# EAGLE design lickometer_1_0 (EAGLE 6.6.0)
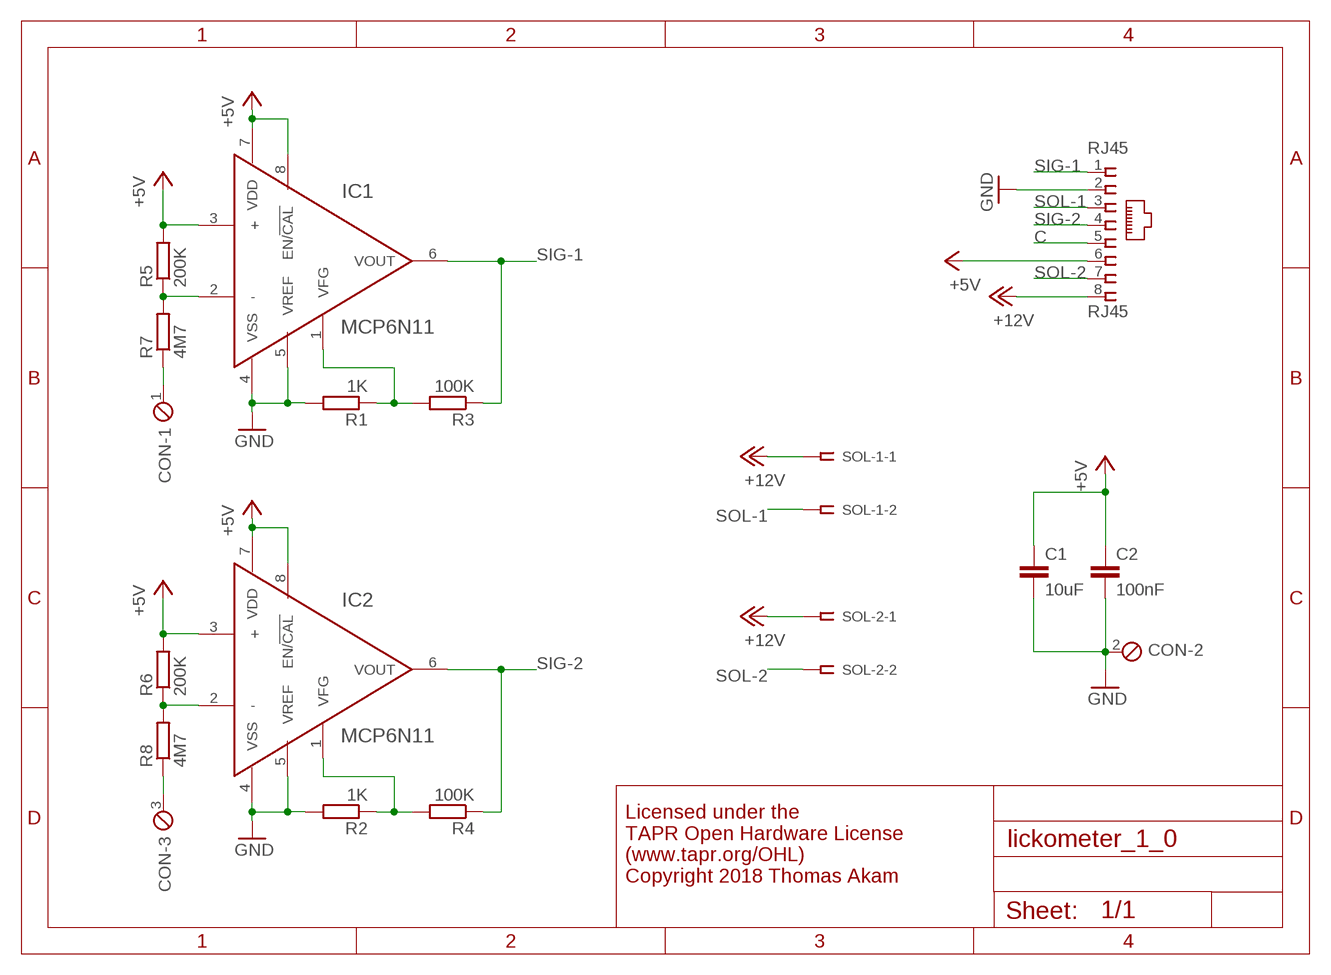
[diagram p0: schematic, sheet 1]

## Parts
C1  10uF  C-EUC1206  [C1206]
C2  100nF  C-EUC0805  [C0805]
CON  MPT3  [3POL254]
IC1  MCP6N11  [SOIC127P600X175-8N]
IC2  MCP6N11  [SOIC127P600X175-8N]
R1  1K  R-EU_R0805  [R0805]
R2  1K  R-EU_R0805  [R0805]
R3  100K  R-EU_R0805  [R0805]
R4  100K  R-EU_R0805  [R0805]
R5  200K  R-EU_R0805  [R0805]
R6  200K  R-EU_R0805  [R0805]
R7  4M7  R-EU_R0805  [R0805]
R8  4M7  R-EU_R0805  [R0805]
RJ45  RJ45  RJ45VERTICAL  [RJ45-NO-SHIELD-VERTICAL]
SOL-1  SSW-102-02-S-S-RA  [SSW-102-02-S-S-RA]
SOL-2  SSW-102-02-S-S-RA  [SSW-102-02-S-S-RA]

## Nets
+5V: C1.1 C2.1 IC1.3(+) IC1.7(VDD) IC1.8(EN/!CAL!) IC2.3(+) IC2.7(VDD) IC2.8(EN/!CAL!) R5.2 R6.2 RJ45.6
+12V: RJ45.8 SOL-1.1 SOL-2.1
C: RJ45.5
GND: C1.2 C2.2 CON.2 IC1.4(VSS) IC1.5(VREF) IC2.4(VSS) IC2.5(VREF) R1.2 R2.2 RJ45.2
N$1: IC2.2(-) R6.1 R8.2
N$2: CON.3 R8.1
N$3: IC1.2(-) R5.1 R7.2
N$4: CON.1 R7.1
N$5: IC1.1(VFG) R1.1 R3.2
N$8: IC2.1(VFG) R2.1 R4.2
SIG-1: IC1.6(VOUT) R3.1 RJ45.1
SIG-2: IC2.6(VOUT) R4.1 RJ45.4
SOL-1: RJ45.3 SOL-1.2
SOL-2: RJ45.7 SOL-2.2

## Notes on the sheet
- Licensed under the 
  TAPR Open Hardware License
  (www.tapr.org/OHL)
  Copyright 2018 Thomas Akam

## Library data of the parts
C1 C2 = resistor:C-EU: CAPACITOR, European symbol
CON = con-phoenix-254:MPT3: PHOENIX CONNECTOR; OC_FARNELL: unknown; OC_NEWARK: unknown
IC1 IC2 = MCP6N11:MCP6N11
R1-R8 = resistor:R-EU_: RESISTOR, European symbol
RJ45 = con-tycoelectronics-vertical_RJ45:RJ45: CORCOM Modular RJ Jacks No Shield Source: www.tycoelectronics.com .. ENG_DS_1654001_1099_RJ_L_0507.pdf
SOL-1 SOL-2 = con-samtec:SSW-102-02-S-S: THROUGH-HOLE .025" SQ POST SOCKET Source: Samtec SSW.pdf; MPN: SSW-102-02-S-S-RA; OC_FARNELL: unknown; OC_NEWARK: 11P9352

## Board
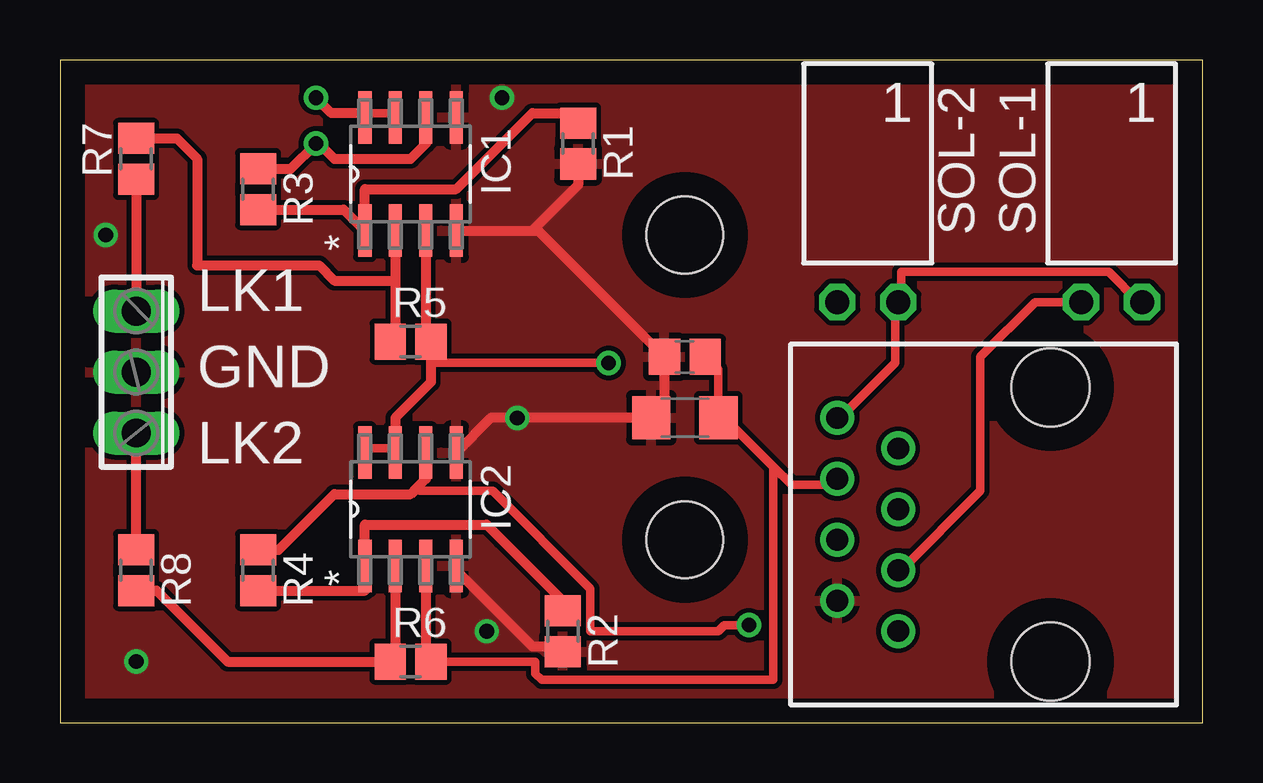
[diagram p1: board, top side]
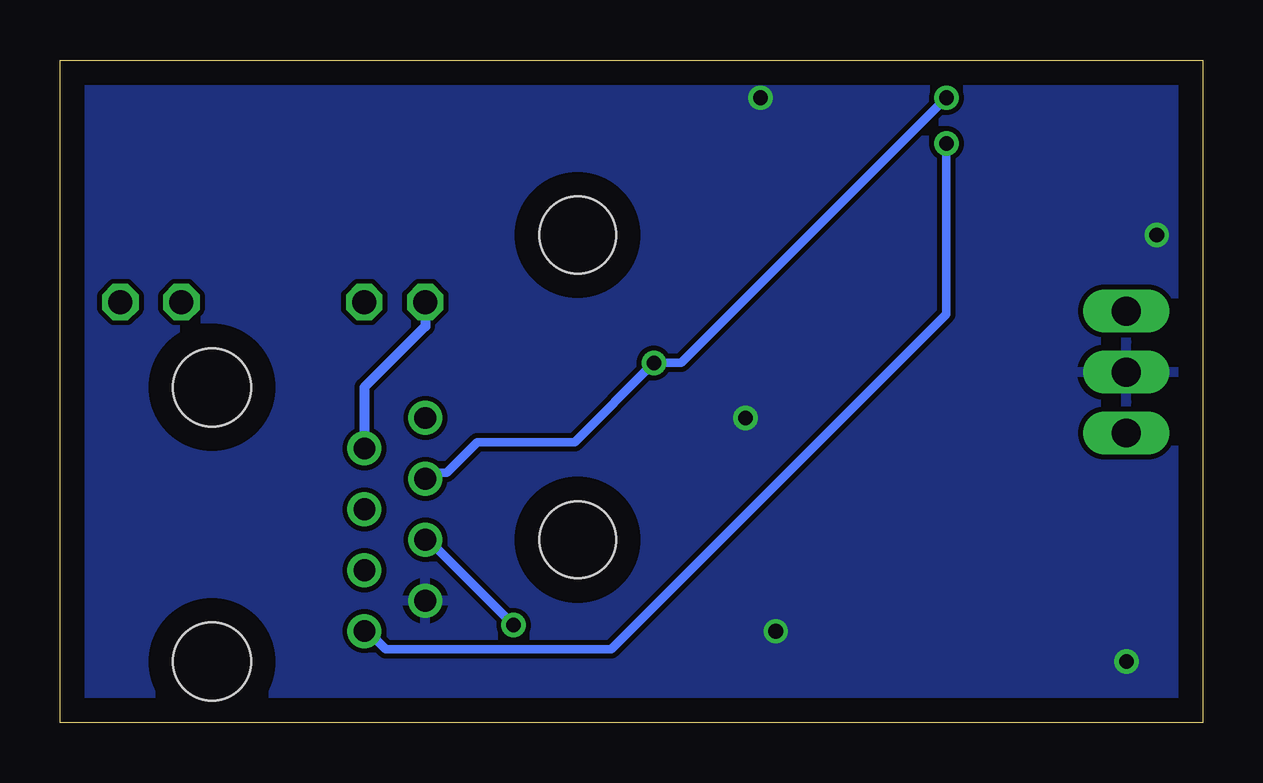
[diagram p2: board, bottom side, seen from below]

Size 47.6 x 27.61 mm. Coordinates in mm from the lower left corner, seen from the top.
Outline: 0,0 47.6,0 47.6,27.61 0,27.61 0,0
Copper layers (1*16): Top 0.035mm / dielectric 1.5mm / Bottom 0.035mm
Design rules "default *": minimum track width 14mil, minimum drill 24mil, track to track 8mil, track to pad 8mil, pad to pad 8mil, via to via 8mil, smd to smd 8mil, copper to edge 40mil, drill to drill 8mil, minimum pad ring 10mil, minimum via ring 8mil, stop-mask expansion 4mil, vias tented up to drill 0mil, thermal gap 10mil
Holes 3.2 mm at 26.04,20.32 26.04,7.62
vRestrict: area 1.3,9.5 to 11.4,19.7

### Footprints (pad centres in the part's own frame; a part is rotated, then mirrored left to right if it is on the bottom)
C1206 = smd 1.6 x 1.8: 1 -1.4,0; 2 1.4,0
C0805 = smd 1.3 x 1.5: 1 -0.85,0; 2 0.85,0
3POL254 = drill 1.2 long: 1 -2.54,0; 2 0,0; 3 2.54,0
SOIC127P600X175-8N = smd 2.184 x 0.559: 1 -2.362,1.905; 2 -2.362,0.635; 3 -2.362,-0.635; 4 -2.362,-1.905; 5 2.362,-1.905; 6 2.362,-0.635; 7 2.362,0.635; 8 2.362,1.905
R0805 = smd 1.3 x 1.5: 1 -0.85,0; 2 0.85,0
RJ45-NO-SHIELD-VERTICAL = drill 0.9 pad 1.4: 1 -4.445,5.08; 2 -3.175,7.62; 3 -1.905,5.08; 4 -0.635,7.62; 5 0.635,5.08; 6 1.905,7.62; 7 3.175,5.08; 8 4.445,7.62 | hole 3.251: -5.715,-1.27; 5.715,-1.27
SSW-102-02-S-S-RA = drill 1 pad 1.5 octagon: 1 -1.27,1.524; 2 1.27,1.524

### Placement (x,y rotation side)
C1  26.04,12.7 180 top
C2  26.04,15.24 180 top
CON  3.17,14.61 270 top
IC1  14.61,22.86 90 top
IC2  14.61,8.89 90 top
R1  21.59,24.13 270 top
R2  20.95,3.81 270 top
R3  8.26,22.23 270 top
R4  8.26,6.35 270 top
R5  14.61,15.88 0 top
R6  14.61,2.54 0 top
R7  3.17,23.5 90 top
R8  3.17,6.35 270 top
RJ45  40.01,8.26 90 top
SOL-1  43.81,19.05 180 top
SOL-2  33.66,19.05 180 top

### Tracks (layer width: path | path; a pad name or v marks a point on that pad's centre or on a via)
+5V  (via drill 0.61)
  Top 0.356: C2.1 26.92,15.24 27.43,14.73 C1.1 27.69,12.7 29.72,10.67 | IC1.7 13.97,25.4 12.7,25.4 IC1.8 | 13.97,11.43 12.7,11.43 IC2.8 | v22.86,14.99 15.46,14.99 | 29.72,10.67 30.48,9.91 32.26,9.91 32.26,10.16 RJ45.6 | R6.2 19.81,2.54 19.81,2.03 20.07,1.78 29.72,1.78 29.72,10.67
  Top 0.406: IC2.3 15.24,2.75 R6.2 | IC1.3 15.24,16.09 R5.2 15.46,14.99 15.46,14.19 13.97,12.7 13.97,11.43 IC2.7 | 12.7,25.4 11.3,25.4 v10.67,26.04
  Bottom 0.356: RJ45.6 32.26,10.16 32,10.41 31.5,10.41 30.23,11.68 26.16,11.68 v22.86,14.99 21.72,14.99 v10.67,26.04
+12V
  Top 0.356: RJ45.8 32.51,12.7 34.8,14.99 34.8,17.53 SOL-2.1 35.05,17.53 35.05,18.8 43.69,18.8 44.96,17.53 SOL-1.1
GND  (via drill 0.61)
  Top 0.356: 16.51,25.4 IC1.5 16.51,25.4
  Top 0.406: IC2.4 16.51,6.35 19.68,3.17 20.74,3.17 R2.2 | IC2.5 17.96,12.7 v19.05,12.7 C1.2 25.18,13.25 C2.2 19.93,20.5 19.68,20.5 | IC1.4 19.68,20.5 | R1.2 21.59,22.4 19.68,20.5
  other vias: 17.78,3.81 18.41,26.04 3.17,2.54 1.91,20.32
  pour Bottom: 47.62,0 47.62,27.94 0,27.94 0,0
  pour Top: 47.62,0 47.62,27.94 0,27.94 0,0
N$1
  Top 0.406: IC2.2 13.97,2.75 R6.1 6.99,2.54 4.03,5.5 R8.2
N$2
  Top 0.406: R8.1 CON.3
N$3
  Top 0.406: 13.97,20.32 IC1.2 13.97,18.41 | 13.97,15.88 R5.1 13.97,16.09 13.97,18.41 | R7.2 4.87,24.34 5.71,23.5 5.71,19.05 10.79,19.05 11.43,18.41 13.97,18.41
N$4
  Top 0.406: R7.1 CON.1
N$5
  Top 0.406: R3.2 11.82,21.38 IC1.1 12.7,22.23 16.51,22.23 19.68,25.4 21.38,25.4 R1.1
N$8
  Top 0.406: R4.2 12.7,5.5 IC2.1 12.7,8.26 17.78,8.26 18.41,7.62 20.95,5.08 R2.1
SIG-1  (via drill 0.61)
  Top 0.406: IC1.6 15.24,24.13 14.61,23.5 11.43,23.5 10.79,24.13 v10.67,24.13 9.61,23.07 R3.1
  Bottom 0.356: v10.67,24.13 10.67,17.02 24.64,3.05 34.04,3.05 34.8,3.81 RJ45.1
SIG-2  (via drill 0.61)
  Top 0.356: v28.7,4.06 27.69,4.06 27.43,3.81 22.1,3.81 22.1,5.59 18.03,9.65 14.99,9.65 14.86,9.78
  Top 0.406: R4.1 9.11,7.2 11.43,9.53 14.61,9.53 14.86,9.78 15.24,10.16 IC2.6
  Bottom 0.356: v28.7,4.06 32.26,7.62 RJ45.4
SOL-1
  Top 0.356: RJ45.3 35.05,6.35 38.35,9.65 38.35,15.24 40.64,17.53 42.42,17.53 SOL-1.2
SOL-2
  Bottom 0.406: SOL-2.2 32.38,16.51 34.92,13.97 RJ45.7

### Text on the board
tPlace: LK1 | GND | LK2
tDocu: Licensed under the TAPR Open Hardware License / (www.tapr.org/OHL) / Copyright 2018 Thomas Akam